# EAGLE schematic schema (EAGLE 9.6.2)
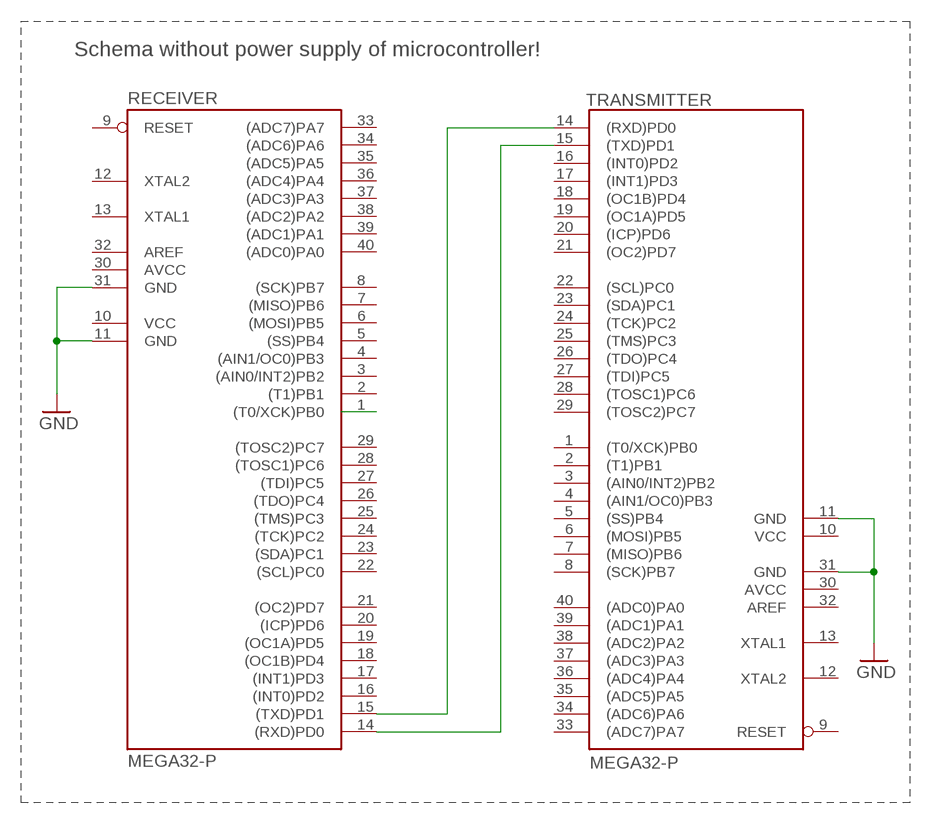
[diagram p0: schematic, sheet 1]

## Parts
RECEIVER  MEGA32-P  [DIL40]
TRANSMITTER  MEGA32-P  [DIL40]

## Nets
GND: RECEIVER.11(GND) RECEIVER.31(GND) TRANSMITTER.11(GND) TRANSMITTER.31(GND)
N$1: RECEIVER.15((TXD)PD1) TRANSMITTER.14((RXD)PD0)
N$2: RECEIVER.14((RXD)PD0) TRANSMITTER.15((TXD)PD1)
PHOTOTRANSISTOR: RECEIVER.1((T0/XCK)PB0)
Unconnected: RECEIVER.2((T1)PB1) RECEIVER.3((AIN0/INT2)PB2) RECEIVER.4((AIN1/OC0)PB3) RECEIVER.5((SS)PB4) RECEIVER.6((MOSI)PB5) RECEIVER.7((MISO)PB6) RECEIVER.8((SCK)PB7) RECEIVER.9(RESET) RECEIVER.12(XTAL2) RECEIVER.13(XTAL1) RECEIVER.16((INT0)PD2) RECEIVER.17((INT1)PD3) RECEIVER.18((OC1B)PD4) RECEIVER.19((OC1A)PD5) RECEIVER.20((ICP)PD6) RECEIVER.21((OC2)PD7) RECEIVER.22((SCL)PC0) RECEIVER.23((SDA)PC1) RECEIVER.24((TCK)PC2) RECEIVER.25((TMS)PC3) RECEIVER.26((TDO)PC4) RECEIVER.27((TDI)PC5) RECEIVER.28((TOSC1)PC6) RECEIVER.29((TOSC2)PC7) RECEIVER.32(AREF) RECEIVER.33((ADC7)PA7) RECEIVER.34((ADC6)PA6) RECEIVER.35((ADC5)PA5) RECEIVER.36((ADC4)PA4) RECEIVER.37((ADC3)PA3) RECEIVER.38((ADC2)PA2) RECEIVER.39((ADC1)PA1) RECEIVER.40((ADC0)PA0) TRANSMITTER.1((T0/XCK)PB0) TRANSMITTER.2((T1)PB1) TRANSMITTER.3((AIN0/INT2)PB2) TRANSMITTER.4((AIN1/OC0)PB3) TRANSMITTER.5((SS)PB4) TRANSMITTER.6((MOSI)PB5) TRANSMITTER.7((MISO)PB6) TRANSMITTER.8((SCK)PB7) TRANSMITTER.9(RESET) TRANSMITTER.12(XTAL2) TRANSMITTER.13(XTAL1) TRANSMITTER.16((INT0)PD2) TRANSMITTER.17((INT1)PD3) TRANSMITTER.18((OC1B)PD4) TRANSMITTER.19((OC1A)PD5) TRANSMITTER.20((ICP)PD6) TRANSMITTER.21((OC2)PD7) TRANSMITTER.22((SCL)PC0) TRANSMITTER.23((SDA)PC1) TRANSMITTER.24((TCK)PC2) TRANSMITTER.25((TMS)PC3) TRANSMITTER.26((TDO)PC4) TRANSMITTER.27((TDI)PC5) TRANSMITTER.28((TOSC1)PC6) TRANSMITTER.29((TOSC2)PC7) TRANSMITTER.32(AREF) TRANSMITTER.33((ADC7)PA7) TRANSMITTER.34((ADC6)PA6) TRANSMITTER.35((ADC5)PA5) TRANSMITTER.36((ADC4)PA4) TRANSMITTER.37((ADC3)PA3) TRANSMITTER.38((ADC2)PA2) TRANSMITTER.39((ADC1)PA1) TRANSMITTER.40((ADC0)PA0)

## Notes on the sheet
- Schema without power supply of microcontroller!

## Power pins joined to a net without a drawn wire
AVCC: RECEIVER.30(AVCC) TRANSMITTER.30(AVCC)
VCC: RECEIVER.10(VCC) TRANSMITTER.10(VCC)

## Library data of the parts
RECEIVER TRANSMITTER = atmel:MEGA32-P: MICROCONTROLLER 32 Kbytes FLASH 2 Kbytes SRAM 1 Kbytes EEPROM USART 8-channel 10 bit ADC Source: www.atmel.com .. doc2503.pdf; MPN: ATMEGA32-16PU; OC_FARNELL: 1661729; OC_NEWARK: 51P1794